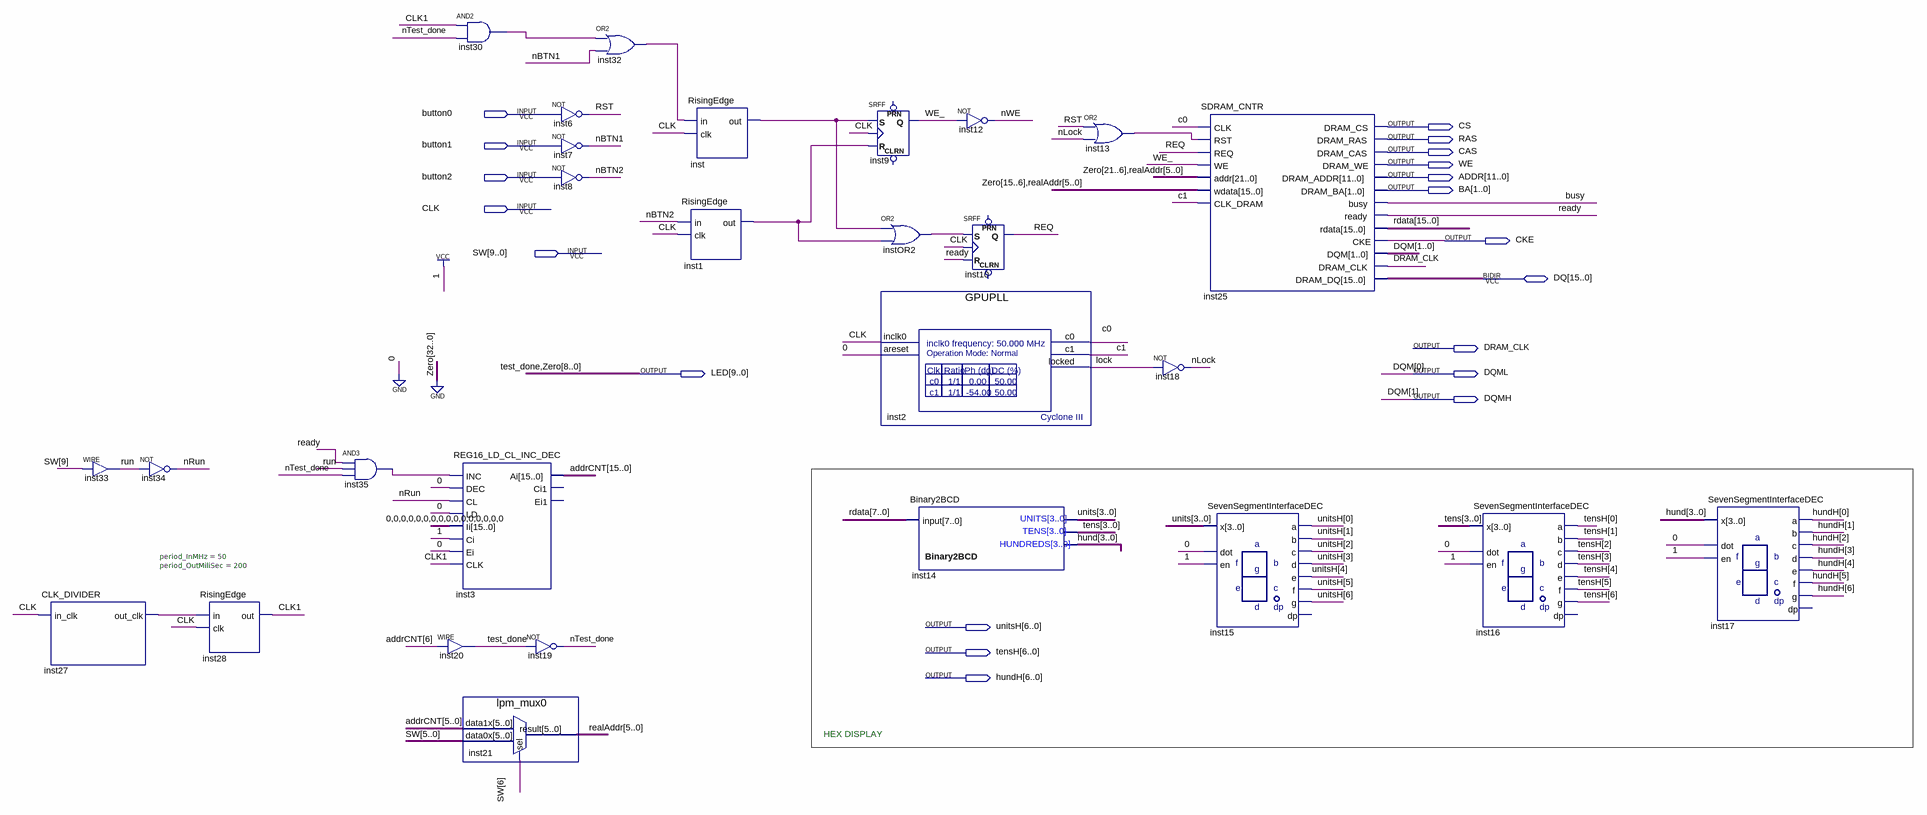
[diagram p0: schematic sheet]
// Quartus schematic sdram_test.bdf as structural Verilog: 28 symbols, 20 pins
module sdram_test (
  input  button0,
  input  button1,
  input  button2,
  input  CLK,
  input  [9:0] SW,
  inout  [15:0] DQ,
  output CS,
  output RAS,
  output CAS,
  output WE,
  output [11:0] ADDR,
  output [1:0] BA,
  output CKE,
  output DRAM_CLK,
  output [9:0] LED,
  output DQML,
  output DQMH,
  output [6:0] unitsH,
  output [6:0] tensH,
  output [6:0] hundH
);

  wire busy, c0, c1, CLK1, inst1_out, inst13_out, inst27_out_clk, inst30_out, inst32_out, inst35_out,
       inst_out, instOR2_out, lock, nBTN1, nBTN2, nLock, nRun, nTest_done, nWE, ready, REQ, RST, run, WE_;
  wire [3:0] hund, tens, units;
  wire [5:0] realAddr;
  wire [15:0] addrCNT, rdata;

  CLK_DIVIDER #(.period_InMHz(50), .period_OutMiliSec(200)) inst27 (.in_clk(CLK), .out_clk(inst27_out_clk));
  assign run = SW[9];  // WIRE inst33
  not inst34 (nRun, run);
  RisingEdge inst28 (.in(inst27_out_clk), .clk(CLK), .out(CLK1));
  and inst35 (inst35_out, ready, run, nTest_done);
  and inst30 (inst30_out, CLK1, nTest_done);
  REG16_LD_CL_INC_DEC inst3 (
    .INC(inst35_out), .DEC(1'b0), .CL(nRun), .LD(1'b0), .Ii({16{1'b0}}), .Ci(1'b1), .Ei(1'b0), .CLK(CLK1),
    .Ai(addrCNT));  // open: Ci1, Ei1
  assign LED[9] = addrCNT[6];  // WIRE inst20
  lpm_mux0 inst21 (.data1x(addrCNT[5:0]), .data0x(SW[5:0]), .sel(SW[6]), .result(realAddr));
  not inst6 (RST, button0);
  not inst7 (nBTN1, button1);
  not inst8 (nBTN2, button2);
  not inst19 (nTest_done, LED[9]);
  or inst32 (inst32_out, inst30_out, nBTN1);
  RisingEdge inst (.in(inst32_out), .clk(CLK), .out(inst_out));
  RisingEdge inst1 (.in(nBTN2), .clk(CLK), .out(inst1_out));
  SRFF inst9 (.S(inst_out), .R(inst1_out), .CLK(CLK), .Q(WE_));  // open: PRN, CLRN
  or instOR2 (instOR2_out, inst_out, inst1_out);
  GPUPLL inst2 (.inclk0(CLK), .areset(1'b0), .c0(c0), .c1(c1), .locked(lock));
  Binary2BCD inst14 (.\input (rdata[7:0]), .bcd_hundreds(hund), .bcd_tens(tens), .bcd_units(units));
  not inst12 (nWE, WE_);
  SRFF inst10 (.S(instOR2_out), .R(ready), .CLK(CLK), .Q(REQ));  // open: PRN, CLRN
  or inst13 (inst13_out, RST, nLock);
  not inst18 (nLock, lock);
  SDRAM_CNTR inst25 (
    .CLK(c0), .RST(inst13_out), .REQ(REQ), .WE(WE_), .addr({{16{1'b0}}, realAddr}),
    .wdata({{10{1'b0}}, realAddr}), .CLK_DRAM(c1), .DRAM_CS(CS), .DRAM_RAS(RAS), .DRAM_CAS(CAS),
    .DRAM_WE(WE), .DRAM_ADDR(ADDR), .DRAM_BA(BA), .busy(busy), .ready(ready), .rdata(rdata), .CKE(CKE),
    .DQM({DQMH, DQML}), .DRAM_CLK(DRAM_CLK), .DRAM_DQ(DQ));
  SevenSegmentInterfaceDEC inst15 (
    .dot(1'b0), .en(1'b1), .x(units), .a(unitsH[0]), .b(unitsH[1]), .c(unitsH[2]), .d(unitsH[3]),
    .e(unitsH[4]), .f(unitsH[5]), .g(unitsH[6]));  // open: dp
  SevenSegmentInterfaceDEC inst16 (
    .dot(1'b0), .en(1'b1), .x(tens), .a(tensH[0]), .b(tensH[1]), .c(tensH[2]), .d(tensH[3]), .e(tensH[4]),
    .f(tensH[5]), .g(tensH[6]));  // open: dp
  SevenSegmentInterfaceDEC inst17 (
    .dot(1'b0), .en(1'b1), .x(hund), .a(hundH[0]), .b(hundH[1]), .c(hundH[2]), .d(hundH[3]), .e(hundH[4]),
    .f(hundH[5]), .g(hundH[6]));  // open: dp

  assign LED[8:0] = {9{1'b0}};

  // Other names for the same wires on the sheet: DQM[1:0] = {DQMH, DQML}; test_done = LED[9]

  // Notes on the sheet:
  //   HEX DISPLAY
endmodule
